# EAGLE design Adafruit_SharpMemoryDisplay (EAGLE 6.3)
CHECKED: KTOWN; COMPANY: ADAFRUIT INDUSTRIES; DRAWN: KTOWN; REV: A
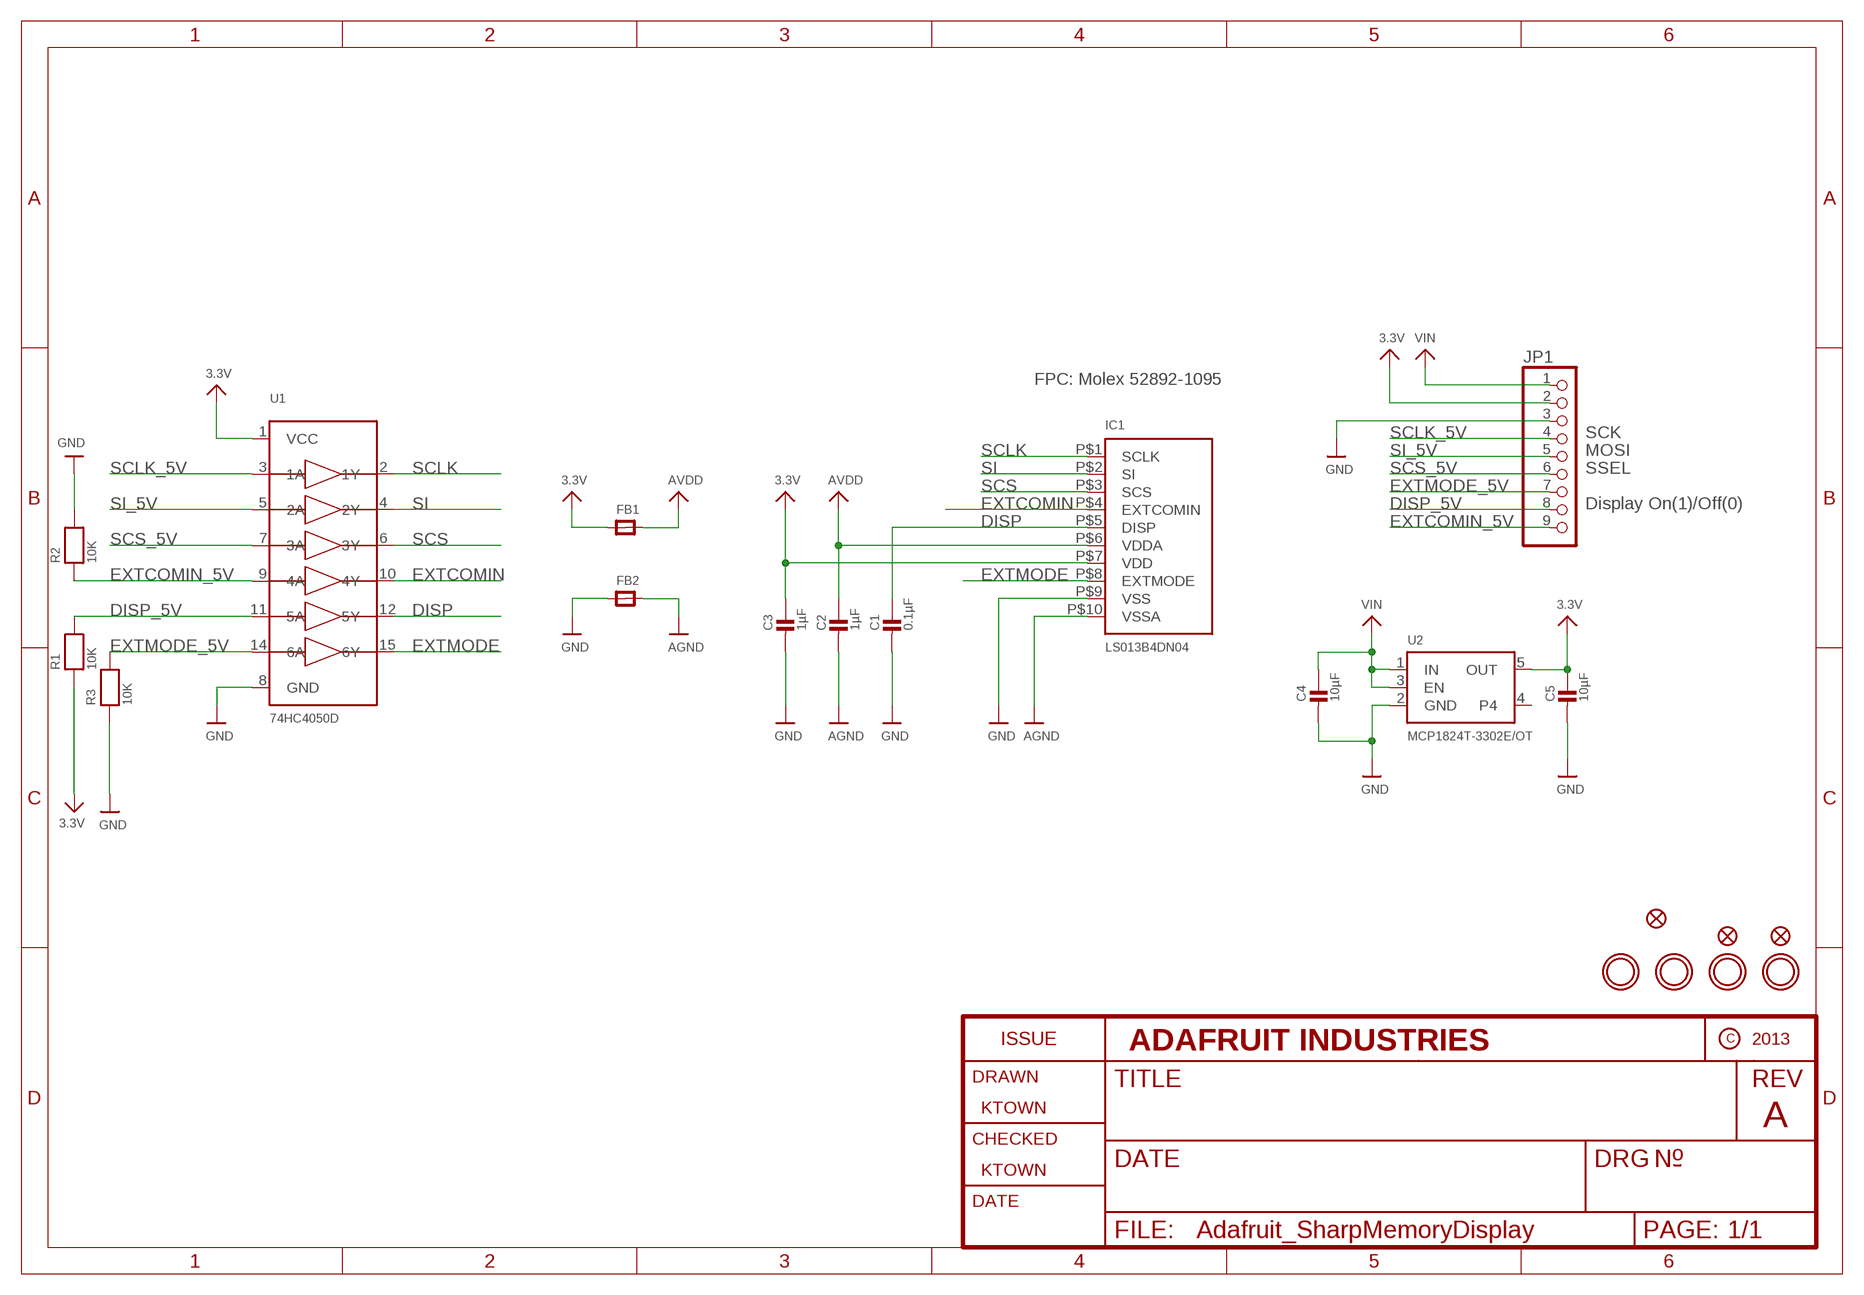
[diagram p0: schematic, sheet 1]

## Parts
C1  0.1µF  CAP_CERAMIC_0805  [_0805]
C2  1µF  CAP_CERAMIC_0805  [_0805]
C3  1µF  CAP_CERAMIC_0805  [_0805]
C4  10µF  CAP_CERAMIC_0805  [_0805]
C5  10µF  CAP_CERAMIC_0805  [_0805]
FB1  FERRITE_0805  [_0805]
FB2  FERRITE_0805  [_0805]
FID1  FIDUCIAL""  [FIDUCIAL_1MM]
FID2  FIDUCIAL""  [FIDUCIAL_1MM]
FID3  FIDUCIAL""  [FIDUCIAL_1MM]
IC1  LS013B4DN04  SHARP_MEMORYLCD_10PIN  [FPC_10PIN_52892-1095]
JP1  HEADER-1X970MIL  [1X09_ROUND_70]
R1  10K  RESISTOR_0805  [_0805]
R2  10K  RESISTOR_0805  [_0805]
R3  10K  RESISTOR_0805  [_0805]
U1  74HC4050D  [SOIC16]
U2  MCP1824T-3302E/OT  VREG_SOT23-5  [SOT23-5]
U$21  MOUNTINGHOLE3.0THIN  [MOUNTINGHOLE_3.0_PLATEDTHIN]
U$22  MOUNTINGHOLE3.0THIN  [MOUNTINGHOLE_3.0_PLATEDTHIN]
U$27  MOUNTINGHOLE3.0THIN  [MOUNTINGHOLE_3.0_PLATEDTHIN]
U$28  MOUNTINGHOLE3.0THIN  [MOUNTINGHOLE_3.0_PLATEDTHIN]

## Nets
3.3V: C3.1 C5.1 FB1.1 IC1.P$7(VDD) JP1.2 R1.1 U1.1(VCC) U2.5(OUT)
AGND: C2.2 FB2.2 IC1.P$10(VSSA)
AVDD: C2.1 FB1.2 IC1.P$6(VDDA)
DISP: C1.1 IC1.P$5(DISP) U1.12(5Y)
DISP_5V: JP1.8 R1.2 U1.11(5A)
EXTCOMIN: IC1.P$4(EXTCOMIN) U1.10(4Y)
EXTCOMIN_5V: JP1.9 R2.1 U1.9(4A)
EXTMODE: IC1.P$8(EXTMODE) U1.15(6Y)
EXTMODE_5V: JP1.7 R3.2 U1.14(6A)
GND: C1.2 C3.2 C4.2 C5.2 FB2.1 IC1.P$9(VSS) JP1.3 R2.2 R3.1 U1.8(GND) U2.2(GND)
SCLK: IC1.P$1(SCLK) U1.2(1Y)
SCLK_5V: JP1.4 U1.3(1A)
SCS: IC1.P$3(SCS) U1.6(3Y)
SCS_5V: JP1.6 U1.7(3A)
SI: IC1.P$2(SI) U1.4(2Y)
SI_5V: JP1.5 U1.5(2A)
VIN: C4.1 JP1.1 U2.1(IN) U2.3(EN)
Unconnected: U2.4

## Notes on the sheet
- FPC: Molex 52892-1095
- SCK
- MOSI
- SSEL
- Display On(1)/Off(0)

## Library data of the parts
C1-C5 = microbuilder:CAP_CERAMIC: Ceramic Capacitors For new designs, use the packages preceded by an '_' character since they are more reliable: The following footprints should be used on most boards: _0402 - Standard footprint for regular board layouts _0603 - Standard footprint for regular board layouts _0805 - Standard footprint for regular board layouts For extremely tight-pitch boards where space is at a premium, the following 'micro-pitch' footprints can be used (smaller pads, no silkscreen outline, etc.): _0402MP - Micro-pitch footprint for very dense/compact boards _0603MP - Micro-pitch footprint for very dense/compact boards _0805MP - Micro-pitch footprint for very dense/compact boards Commonly Stocked Parts 0402 - 0402 Surface Mount Capacitors 16pF 50V 5% [Digikey: 445-4899-2-ND] 18pF 50V 5% [Digikey: 490-1281-2-ND] 22pF 50V 5% [Digikey: 490-1283-2-ND] 68pF 50V 5% [Digikey: 490-1289-2-ND] 0.1uF 10V 10% [Digikey: 490-1318-2-ND] 1.0uF 6.3V 10% [Digikey: 490-1320-2-ND] 0603 - 0603 Surface Mount Capacitors 16 pF 50V 5% [Digikey: 445-5051-2-ND] 22 pF 50V [Digikey: PCC220ACVTR-ND] 33 pF 50V 5% [Digikey: 490-1415-1-ND] 56pF 50V 5% [Digikey: 490-1421-1-ND] 220pF 50V 5% [Digikey: 445-1285-1-ND] 680 pF 50V 2200 pF 50V 5% C0G [Digikey: 445-1297-1-ND] 5600 pF 100V 5% X7R [Digikey: 478-3711-1-ND] 0.1 µF 25V 10% [Digikey: PCC2277TR-ND] 0.22 µF 16V 10% X7R [Digikey: 445-1318-1-ND] 1.0 µF 25V 10% [Digikey: 445-5146-2-ND] 0603 - RF Specific 3pF 250V +/-0.1pF RF [Digikey: 712-1347-1-ND] 18 pF 250V 5% [Digikey: 478-3505-1-ND or 712-1322-1-ND] 56 pF 250V 5% C0G RF [Digikey: 490-4867-1-ND] 68 pF 250V RF [Digikey: 490-4868-1-ND] 0805 - 0805 Surface Mount Capacitors 220 pF 250V 2% RF Ceramic Capacitor [Digikey: 712-1398-1-ND] 1000 pF 50V 2% NP0 Ceramic Capacitor [Digikey: 478-3760-1-ND] 0.1 µF 25V 10% Ceramic Capacitor [Digikey: PCC1828TR-ND] 1.0 µF 16V 10% Ceramic Capacitor[Digikey: 490-1691-2-ND] 10.0 µF 10V 10% Ceramic Capacitor[Digikey: 709-1228-1-ND] 10.0 uF 16V 10% Ceramic Capacitor [Digikey: 478-5165-2-ND] 47 uF 6.3V 20% Ceramic Capacitor [Digikey: 587-1779-1-ND or 399-5506-1-ND] 1206 - 1206 Surface Mount Capacitors 47uF 10V 20% Ceramic Capacitor [Digikey: 490-5528-1-ND or 399-5508-1-ND or 445-6010-1-ND] 100uF 6.3V -20%, +80% Y5V Ceramic Capacitor (Digikey: 490-4512-1-ND, Mouser: 81-GRM31CF50J107ZE1L)
FB1 FB2 = microbuilder:FERRITE: Ferrite Bead 0603 MMZ1608B121C - 120 Ohm @ 100MHz, 600mA, 0.15 Ohm DC Resistance - Digikey: 445-2164-1-ND BK1608HW121-T - 120 Ohm, 600mA Ferrite Chip - Digikey: 587-1876-2-ND 0805 HZ0805B272R-10 - 2.7K Ohm @ 100MHz, 200mA, 0.8 Ohm DC Resistance - Digikey: 240-2504-1-ND (see also Murata BLM21BD272SN1L) MMZ2012Y152B - 1.5K Ohm @ 100MHz, 500mA, 0.4 Ohm DC Resistance - Digikey: 445-1560-1-ND - Mainly for high frequency (80-400MHz) MMZ2012R102A - 1K Ohm @ 100MHz, 500mA, 0.3 Ohm DC Resistance - Digikey: 445-1555-2-ND - More general purpose (10-200MHz)
FID1-FID3 = microbuilder:FIDUCIAL: Fiducial Alignment Points Various fiducial points for machine vision alignment.
IC1 = microbuilder:SHARP_MEMORYLCD_10PIN: Sharp Mono Memory LCD LS013B4DN02 - 1.35" 96x96 Pixels LS027B7DH01 - 2.7" 400x240 Pixels
JP1 = microbuilder:HEADER-1X9: PIN HEADER
R1-R3 = microbuilder:RESISTOR: Resistors For new designs, use the packages preceded by an '_' character since they are more reliable: The following footprints should be used on most boards: _0402 - Standard footprint for regular board layouts _0603 - Standard footprint for regular board layouts _0805 - Standard footprint for regular board layouts For extremely tight-pitch boards where space is at a premium, the following 'micro-pitch' footprints can be used (smaller pads, no silkscreen outline, etc.): _0402MP - Micro-pitch footprint for very dense/compact boards _0603MP - Micro-pitch footprint for very dense/compact boards _0805MP - Micro-pitch footprint for very dense/compact boards
U1 = microbuilder:74HC4050D: 6-channel level shifter 74HC4050D - 2V-6V Supply SOIC16 Digikey: 74HC4050D,653-ND Mouser: 771-74HC4050D-T TSSOP16 Digikey: 296-9215-1-ND Mouser:
U2 = microbuilder:VREG_SOT23-5: SOT23-5 Fixed Voltage Regulators Part Current Out V Out V In V Dropout θJA (°C/W) TJ (°C) Digikey Part No. ADP121 150mA 3.3V 3.4-5.5V 0.09V @ 150mA -- -- ADP121-AUJZ33R7CT-ND ADP121 150mA 3.0V 3.1-5.5V 0.09V @ 150mA -- -- ADP121-AUJZ30R7CT-ND ADP122 300mA 3.3V 3.4-5.5V 0.085V @ 300mA -- -- ADP122AUJZ-3.3-R7CT-ND ADP1712 300mA 3.3V 3.5-5.5V 0.17V @ 300mA -- -- ADP1712AUJZ-3.3-R7TR-ND AP7311 (Low Cost) 150mA 3.3V 3.5-6V 0.15V @ 150mA -- -- AP7311-33WG-7DICT-ND LD39015M18R 150mA 1.8V 1.9V-5.5V 0.08V @ 100mA -- -- 497-6977-1-ND LP2985A-33DBVR 150mA 3.3V 3.3-16V 0.28V @ 150mA 206 150 296-18479-1-ND MCP1824T-3302E/OT 300mA 3.3V 3.5V-6V 0.2V @ 300mA -- -- MCP1824T-3302E/OTCT-ND MIC5205-2.5YM5 TR 150mA 2.5V 2.7-16V 0.165V @ 150mA -- -- 576-1257-2-ND MIC5205-3.0YM5 TR 150mA 3.0V 3.2V-16V 0.165V @ 150mA -- -- 576-1258-2-ND MIC5205-3.3YM5 TR 150mA 3.3V 3.5V-16V 0.165V @ 150mA -- -- 576-1259-2-ND TPS780330220 150mA 3.3V+2.2V 3.6-5.5V 250mV Max -- -- 296-23332-1-ND TDA3663/N1,135 100mA 3.3V 3.5-45V 0.18V @ 50mA -- -- 568-5343-1-ND Max operating temp can be calculated using θJA, TJ (max junction temperature), and power in watts. Set the "Maximum Ambient Temperature" until it reaches TJ ("Max Junction Temperature"), which is the absolute limit for safe use of the regulator: Heat Sink Temperature Calculator <http://www.daycounter.com/Calculators/Heat-Sink-Temperature-Calculator.phtml> For example, With 12V source into a 3.3V LP2985 and a 30mA load, we are dissipating (12V-3.3V) * 0.03A = 0.261W. With a θJA of 206 °C/W, a TJ of 150°C, and 261mW we can safely use the chip without a heat sink up to 75°C (=147.1°C Junction Temperature).
U$21 U$22 U$27 U$28 = microbuilder:MOUNTINGHOLE: Mounting Hole For #2 screws (0.086"/2.18mm width, 0.094"/2.4mm hole) use 2.5mm

## Board
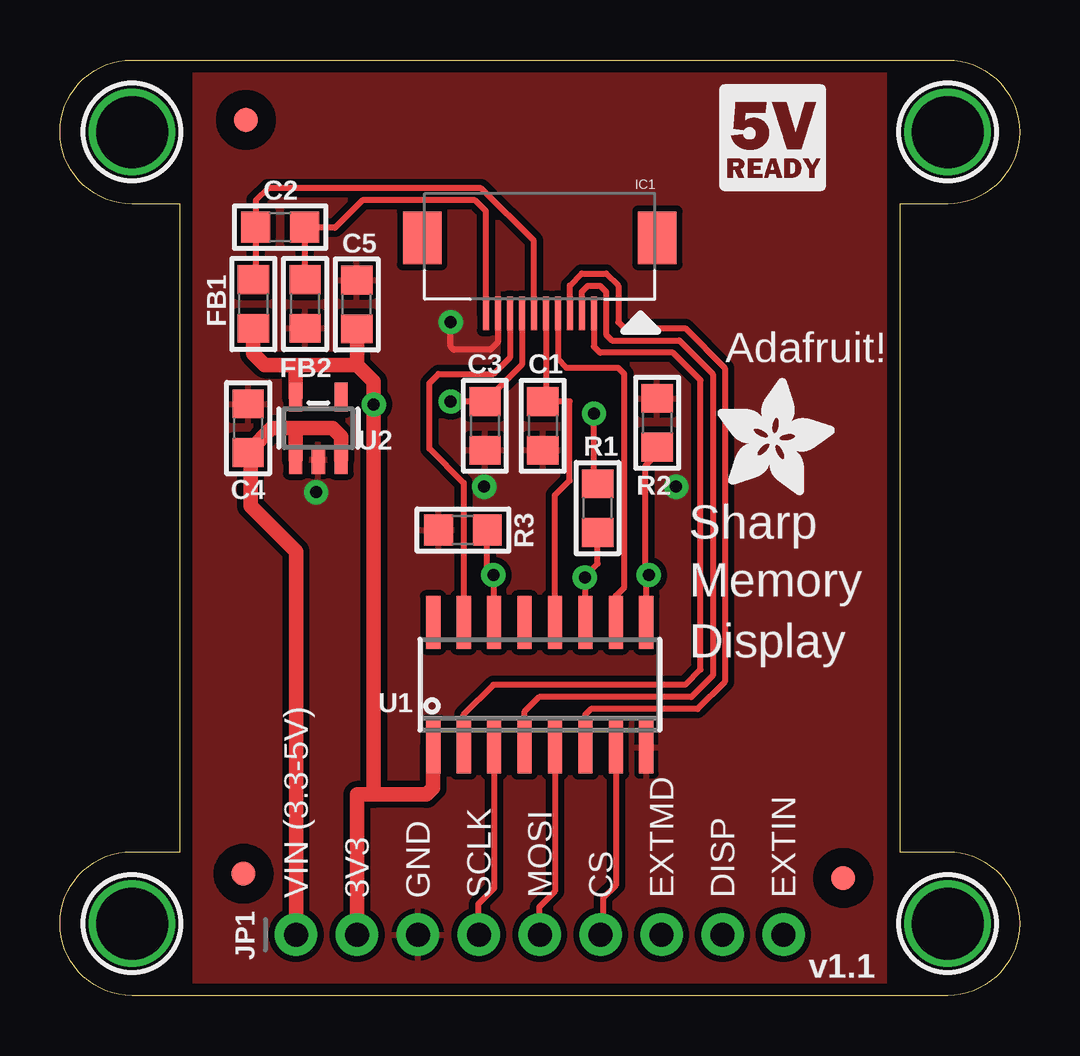
[diagram p1: board, top side]
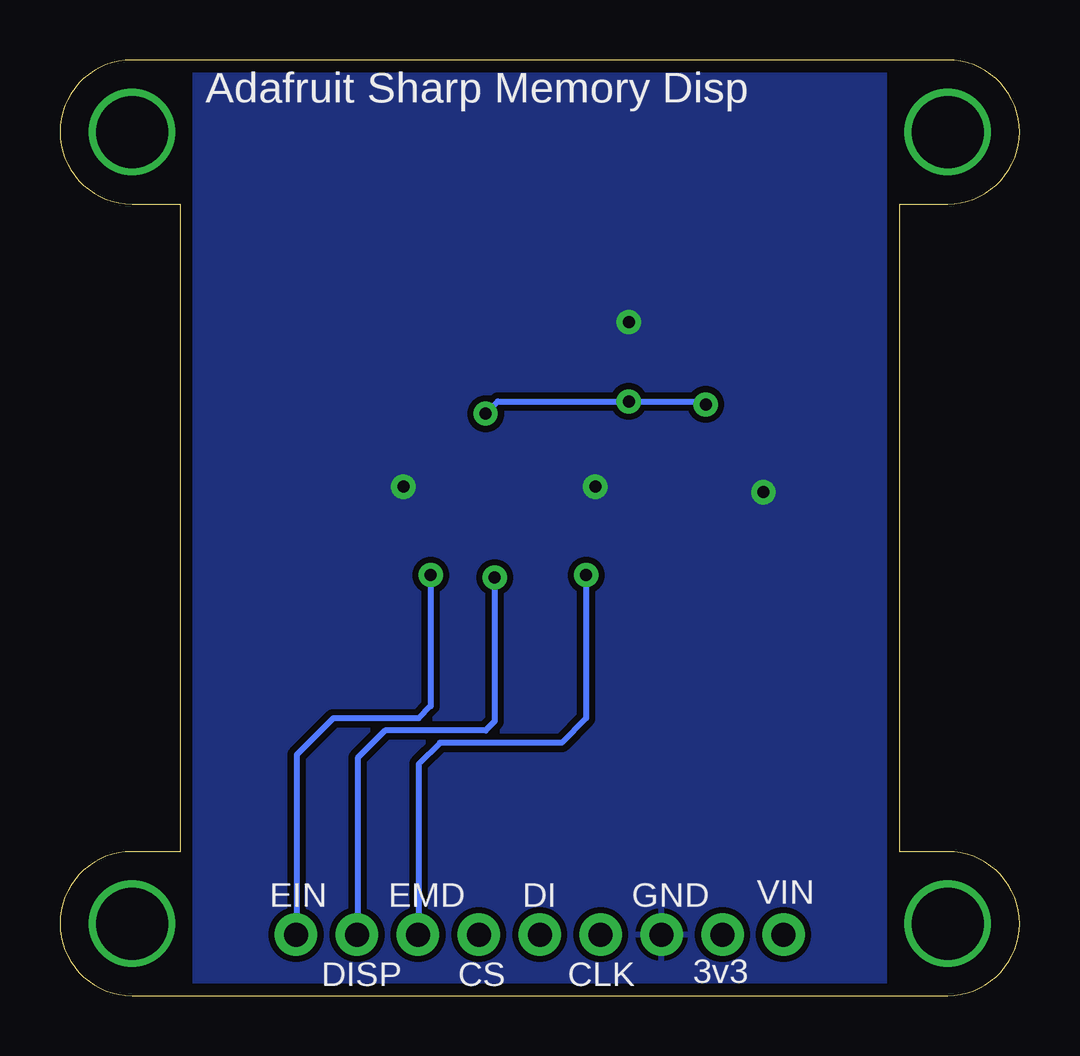
[diagram p2: board, bottom side, seen from below]

Size 40 x 39 mm. Coordinates in mm from the lower left corner, seen from the top.
Outline: 0,3 arc-90 3,6 5,6 5,33 3,33 arc-90 0,36 arc-90 3,39 37,39 arc-90 40,36 arc-90 37,33 35,33 35,6 37,6 arc-90 40,3 arc-90 37,0 3,0 arc-90 0,3
Copper layers (1*16): Top 0.035mm / dielectric 1.5mm / Bottom 0.035mm
Design rules "PCBCart-Standard": minimum track width 8mil, minimum drill 0.4mm, track to track 8mil, track to pad 8mil, pad to pad 8mil, via to via 8mil, smd to smd 8mil, copper to edge 20mil, drill to drill 8mil, minimum pad ring 8mil, minimum via ring 10mil, stop-mask expansion 3mil, vias tented up to drill 20mil, thermal gap 8mil

### Footprints (pad centres in the part's own frame; a part is rotated, then mirrored left to right if it is on the bottom)
_0805 = smd 1.2 x 1.3: 1 -1.016,0; 2 1.016,0
FIDUCIAL_1MM = smd 1 x 1: 1 0,0
FPC_10PIN_52892-1095 = smd 0.25 x 1.4: P$1 -2.25,0; P$2 -1.75,0; P$3 -1.25,0; P$4 -0.75,0; P$5 -0.25,0; P$6 0.25,0; P$7 0.75,0; P$8 1.25,0; P$9 1.75,0; P$10 2.25,0 | smd 1.6 x 2.2: SUPPORT1 -4.9,-3.15; SUPPORT2 4.9,-3.15
1X09_ROUND_70 = drill 1 pad 1.778: 1 -10.16,0; 2 -7.62,0; 3 -5.08,0; 4 -2.54,0; 5 0,0; 6 2.54,0; 7 5.08,0; 8 7.62,0; 9 10.16,0
SOIC16 = smd 0.6 x 2.2: 1 -4.445,-2.6; 2 -3.175,-2.6; 3 -1.905,-2.6; 4 -0.635,-2.6; 5 0.635,-2.6; 6 1.905,-2.6; 7 3.175,-2.6; 8 4.445,-2.6; 9 4.445,2.6; 10 3.175,2.6; 11 1.905,2.6; 12 0.635,2.6; 13 -0.635,2.6; 14 -1.905,2.6; 15 -3.175,2.6; 16 -4.445,2.6
SOT23-5 = smd 0.55 x 1.2: 1 -0.95,-1.3; 2 0,-1.3; 3 0.95,-1.3; 4 0.95,1.3; 5 -0.95,1.3
MOUNTINGHOLE_3.0_PLATEDTHIN = drill 3 pad 3.6: P$1 0,0

### Placement (x,y rotation side)
C1  20.13,23.75 270 top
C2  9.18,32.03 0 top
C3  17.71,23.75 270 top
C4  7.85,23.65 90 top
C5  12.37,28.81 90 top
FB1  8.06,28.83 90 top
FB2  10.22,28.83 90 top
FID1  32.65,4.9 0 top
FID2  7.75,36.5 0 top
FID3  7.65,5.08 0 top
IC1  20,28.43 180 top
JP1  20,2.54 0 top
R1  22.41,20.32 270 top
R2  24.89,23.88 90 top
R3  16.8,19.4 0 top
U1  20,12.95 0 top
U2  10.77,23.65 0 top
U$19  [LOGIC_5VREADY_5MM]  27.21,33.27 0 top
U$21  3,36 0 top
U$22  37,36 0 top
U$27  3,3 0 top
U$28  37,3 0 top
U$29  [ADAFRUIT_5MM]  27.42,20.87 0 top

### Tracks (layer width: path | path; a pad name or v marks a point on that pad's centre or on a via)
3.3V  (via drill 0.5)
  Top 0.254: IC1.P$7 19.25,26.3 C3.1 v16.29,24.77 | R1.1 22.26,21.49 v22.26,24.26
  Top 0.61: JP1.2 12.38,8.38 13.08,8.38 | 12.38,26.29 12.38,27.75 C5.1 | FB1.1 8.06,26.77 8.54,26.29 9.65,26.29 | 9.65,26.29 12.38,26.29 | U2.5 9.82,26.26 9.65,26.29 | U1.1 15.55,8.66 15.27,8.38 13.08,8.38 | 12.38,26.29 13.08,25.59 v13.08,24.64 13.08,8.38
  Bottom 0.254: v13.08,24.64 13.21,24.77 v16.29,24.77 21.75,24.77 v22.26,24.26
AGND
  Top 0.254: FB2.2 10.19,29.87 C2.2 10.22,32 11.46,32 12.61,33.15 17.3,33.15 17.75,32.7 IC1.P$10
AVDD
  Top 0.254: FB1.2 8.16,29.94 C2.1 8.16,33.15 8.67,33.66 17.56,33.66 19.75,31.46 IC1.P$6
DISP
  Top 0.254: IC1.P$5 20.25,24.89 C1.1 21.24,24.77 21.24,21.46 20.64,20.86 U1.12
DISP_5V  (via drill 0.5)
  Top 0.254: U1.11 21.91,17.5 | 21.91,17.5 v21.88,17.43 | 21.91,17.5 22.41,18 R1.2
  Bottom 0.254: v21.88,17.43 21.88,11.43 22.26,11.05 26.45,11.05 27.59,9.91 27.59,2.57 JP1.8
EXTCOMIN
  Top 0.254: U1.10 23.18,16.67 23.53,17.02 23.53,25.91 23.27,26.16 21.11,26.16 20.75,26.53 IC1.P$4
EXTCOMIN_5V  (via drill 0.5)
  Top 0.254: U1.9 24.45,17.43 v24.54,17.53 24.42,17.65 24.42,22.1 24.89,22.58 R2.1
  Bottom 0.254: v24.54,17.53 24.54,12.06 25.05,11.56 28.61,11.56 30.13,10.03 30.13,2.57 JP1.9
EXTMODE
  Top 0.254: IC1.P$8 18.75,26.59 18.07,25.91 15.78,25.91 15.4,25.53 15.4,22.8 16.82,21.38 U1.15
EXTMODE_5V  (via drill 0.5)
  Top 0.254: U1.14 18.09,17.5 v18.07,17.53 17.81,17.78 R3.2
  Bottom 0.254: v18.07,17.53 18.07,11.56 19.08,10.54 24.16,10.54 25.05,9.65 25.05,2.57 JP1.7
GND  (via drill 0.5)
  Top 0.254: IC1.P$9 18.25,27.23 17.94,26.92 16.41,26.92 16.29,27.05 v16.29,28.07
  other vias: 25.69,21.21 17.68,21.21 10.68,20.98
  pour Top (isolate 0.254): 5.65,39 34.35,39 34.35,0 5.65,0
  pour Bottom (isolate 0.254): 34.35,39 5.65,39 5.65,0 34.35,0
SCLK
  Top 0.254: IC1.P$1 22.25,27.06 22.51,26.8 25.56,26.8 26.7,25.65 26.7,13.59 26.07,12.95 18.07,12.95 16.82,11.71 U1.2
SCLK_5V
  Top 0.254: U1.3 18.09,4.47 17.43,3.81 17.43,2.57 JP1.4
SCS
  Top 0.254: IC1.P$3 21.25,29.6 21.75,30.1 22.77,30.1 23.27,29.59 23.27,28.07 23.53,27.81 26.07,27.81 27.72,26.16 27.72,13.08 26.57,11.94 22.13,11.94 21.91,11.71 U1.6
SCS_5V
  Top 0.254: U1.7 23.18,4.6 22.64,4.06 22.64,2.64 JP1.6
SI
  Top 0.254: IC1.P$2 21.75,29.34 22,29.59 22.51,29.59 22.77,29.34 22.77,27.56 23.02,27.3 25.81,27.3 27.21,25.91 27.21,13.34 26.32,12.45 19.97,12.45 19.36,11.84 U1.4
SI_5V
  Top 0.254: U1.5 20.64,4.35 19.97,3.68 19.97,2.57 JP1.5
VIN
  Top 0.61: JP1.1 9.84,18.51 7.94,20.41 7.94,22.54 | 7.94,22.54 C4.1 | 7.94,22.54 7.94,22.76 8.83,23.65 9.98,23.65 | 9.98,23.65 11.37,23.65 11.72,23.3 U2.3 | U2.1 9.82,23.49 9.98,23.65

### Text on the board
tPlace: Adafruit! | Sharp | Memory | Display | VIN (3.3-5V) | 3V3 | GND | SCLK | MOSI | CS | EXTMD | DISP | EXTIN | v1.1
bPlace: Adafruit Sharp Memory Disp | VIN | GND | DI | EMD | EIN | 3v3 | CLK | CS | DISP